# EAGLE design TestBoardRevA (EAGLE 7.5.0)
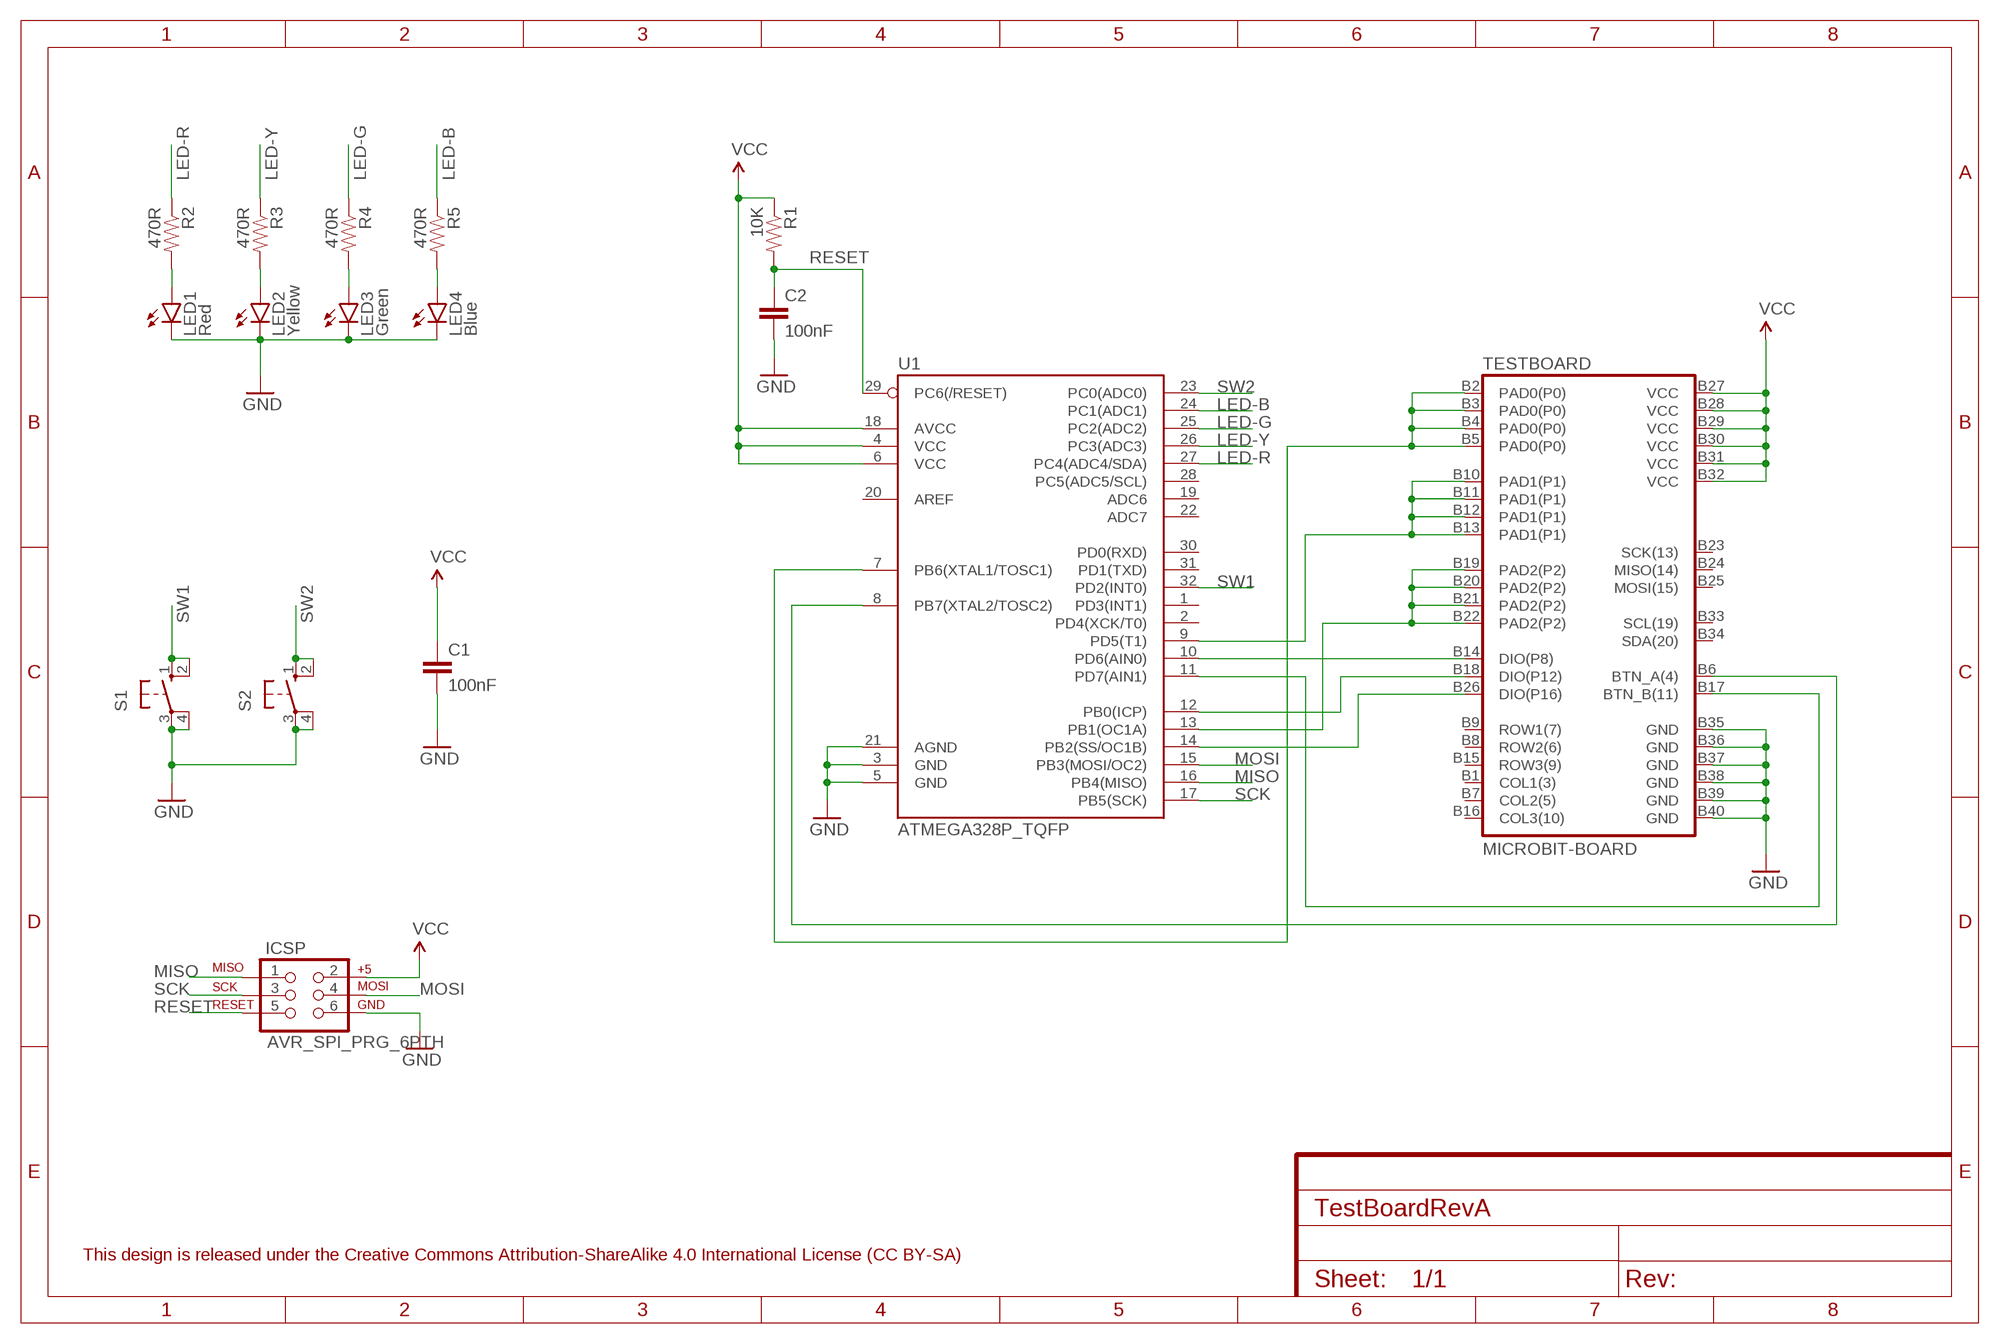
[diagram p0: schematic, sheet 1]
FRAME1 (FRAME-A4L): CNAME: MicroBit Test Board; CREVISION: A 12/2015; DESIGNER: A J Instone-Cowie

## Parts
C1  100nF  CAP0603-CAP  [0603-CAP]
C2  100nF  CAP0603-CAP  [0603-CAP]
ICSP  AVR_SPI_PRG_6PTH  [2X3]
LED1  Red  LED0603  [LED-0603]
LED2  Yellow  LED0603  [LED-0603]
LED3  Green  LED0603  [LED-0603]
LED4  Blue  LED0603  [LED-0603]
R1  10K  RESISTOR0603-RES  [0603-RES]
R2  470R  RESISTOR0603-RES  [0603-RES]
R3  470R  RESISTOR0603-RES  [0603-RES]
R4  470R  RESISTOR0603-RES  [0603-RES]
R5  470R  RESISTOR0603-RES  [0603-RES]
S1  10-XX  [B3F-10XX]
S2  10-XX  [B3F-10XX]
TESTBOARD  MICROBIT-BOARD  [MICROBIT-EDGE-CONN]
U1  ATMEGA328P_TQFP  [TQFP32-08]

## Nets
GND: C1.2 C2.2 ICSP.6 LED1.C LED2.C LED3.C LED4.C S1.3(P) S1.4(P1) S2.3(P) S2.4(P1) TESTBOARD.B35(GND) TESTBOARD.B36(GND) TESTBOARD.B37(GND) TESTBOARD.B38(GND) TESTBOARD.B39(GND) TESTBOARD.B40(GND) U1.3(GND) U1.5(GND) U1.21(AGND)
LED-B: R5.1 U1.24(PC1(ADC1))
LED-G: R4.1 U1.25(PC2(ADC2))
LED-R: R2.1 U1.27(PC4(ADC4/SDA))
LED-Y: R3.1 U1.26(PC3(ADC3))
MISO: ICSP.1 U1.16(PB4(MISO))
MOSI: ICSP.4 U1.15(PB3(MOSI/OC2))
N$1: LED3.A R4.2
N$2: TESTBOARD.B2(PAD0(P0)) TESTBOARD.B3(PAD0(P0)) TESTBOARD.B4(PAD0(P0)) TESTBOARD.B5(PAD0(P0)) U1.7(PB6(XTAL1/TOSC1))
N$3: TESTBOARD.B6(BTN_A(4)) U1.8(PB7(XTAL2/TOSC2))
N$4: TESTBOARD.B19(PAD2(P2)) TESTBOARD.B20(PAD2(P2)) TESTBOARD.B21(PAD2(P2)) TESTBOARD.B22(PAD2(P2)) U1.13(PB1(OC1A))
N$5: LED4.A R5.2
N$6: TESTBOARD.B10(PAD1(P1)) TESTBOARD.B11(PAD1(P1)) TESTBOARD.B12(PAD1(P1)) TESTBOARD.B13(PAD1(P1)) U1.9(PD5(T1))
N$8: LED1.A R2.2
N$10: TESTBOARD.B14(DIO(P8)) U1.10(PD6(AIN0))
N$11: TESTBOARD.B18(DIO(P12)) U1.12(PB0(ICP))
N$12: TESTBOARD.B26(DIO(P16)) U1.14(PB2(SS/OC1B))
N$13: TESTBOARD.B17(BTN_B(11)) U1.11(PD7(AIN1))
N$16: LED2.A R3.2
RESET: C2.1 ICSP.5 R1.2 U1.29(PC6(/RESET))
SCK: ICSP.3 U1.17(PB5(SCK))
SW1: S1.1(S) S1.2(S1) U1.32(PD2(INT0))
SW2: S2.1(S) S2.2(S1) U1.23(PC0(ADC0))
VCC: C1.1 ICSP.2 R1.1 TESTBOARD.B27(VCC) TESTBOARD.B28(VCC) TESTBOARD.B29(VCC) TESTBOARD.B30(VCC) TESTBOARD.B31(VCC) TESTBOARD.B32(VCC) U1.4(VCC) U1.6(VCC) U1.18(AVCC)
Unconnected: TESTBOARD.B1(COL1(3)) TESTBOARD.B7(COL2(5)) TESTBOARD.B8(ROW2(6)) TESTBOARD.B9(ROW1(7)) TESTBOARD.B15(ROW3(9)) TESTBOARD.B16(COL3(10)) TESTBOARD.B23(SCK(13)) TESTBOARD.B24(MISO(14)) TESTBOARD.B25(MOSI(15)) TESTBOARD.B33(SCL(19)) TESTBOARD.B34(SDA(20)) U1.1(PD3(INT1)) U1.2(PD4(XCK/T0)) U1.19(ADC6) U1.20(AREF) U1.22(ADC7) U1.28(PC5(ADC5/SCL)) U1.30(PD0(RXD)) U1.31(PD1(TXD))

## Notes on the sheet
- This design is released under the Creative Commons Attribution-ShareAlike 4.0 International License (CC BY-SA)

## Library data of the parts
C1 C2 = SparkFun-Capacitors:CAP: Capacitor Standard 0603 ceramic capacitor, and 0.1" leaded capacitor.
ICSP = SparkFun-Connectors:AVR_SPI_PRG_6: AVR ISP 6 Pin This is the reduced ISP connector for AVR programming. Common on Arduino. This footprint will take up less PCB space and can be used with a 10-pin to 6-pin adapter such as SKU: BOB-08508 **Special note about "TEST_POINT" package. The stop mask is on the top side, so if you want your programming test points to be on the bottom of your board, make sure to place this package on the bottom side of the board. This also ensure that the orientation to program from the bottom side will be correct.
LED1-LED4 = SparkFun-LED:LED: LEDs Standard schematic elements and footprints for 5mm, 3mm, 1206, and 0603 sized LEDs. 5mm - Spark Fun Electronics SKU : COM-00529 (and others)
R1-R5 = SparkFun-Passives:RESISTOR: Resistor Basic schematic elements and footprints for 0603, 1206, and PTH resistors.
S1 S2 = switch-omron:10-XX: OMRON SWITCH; MPN: B3F-1000; OC_FARNELL: 176432; OC_NEWARK: 36M3542
TESTBOARD = MicroBit_Custom:MICROBIT-: Not yet complete or validated - DO NOT USE
U1 = SparkFun-DigitalIC:ATMEGA328P_TQFP; PROD_ID: IC-09069

## Board
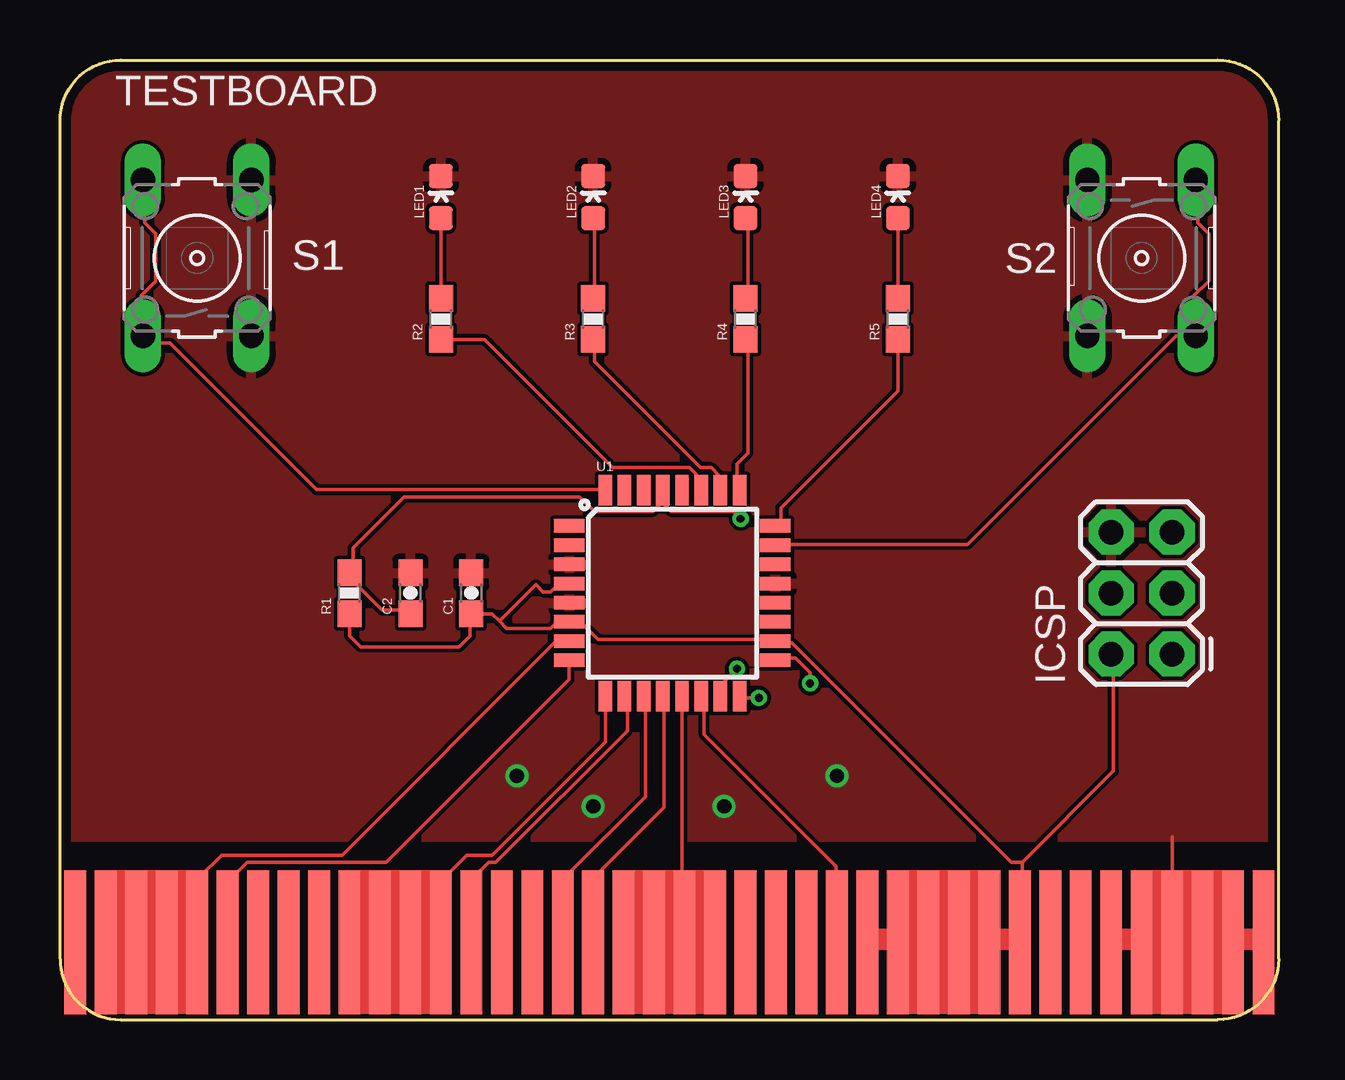
[diagram p1: board, top side]
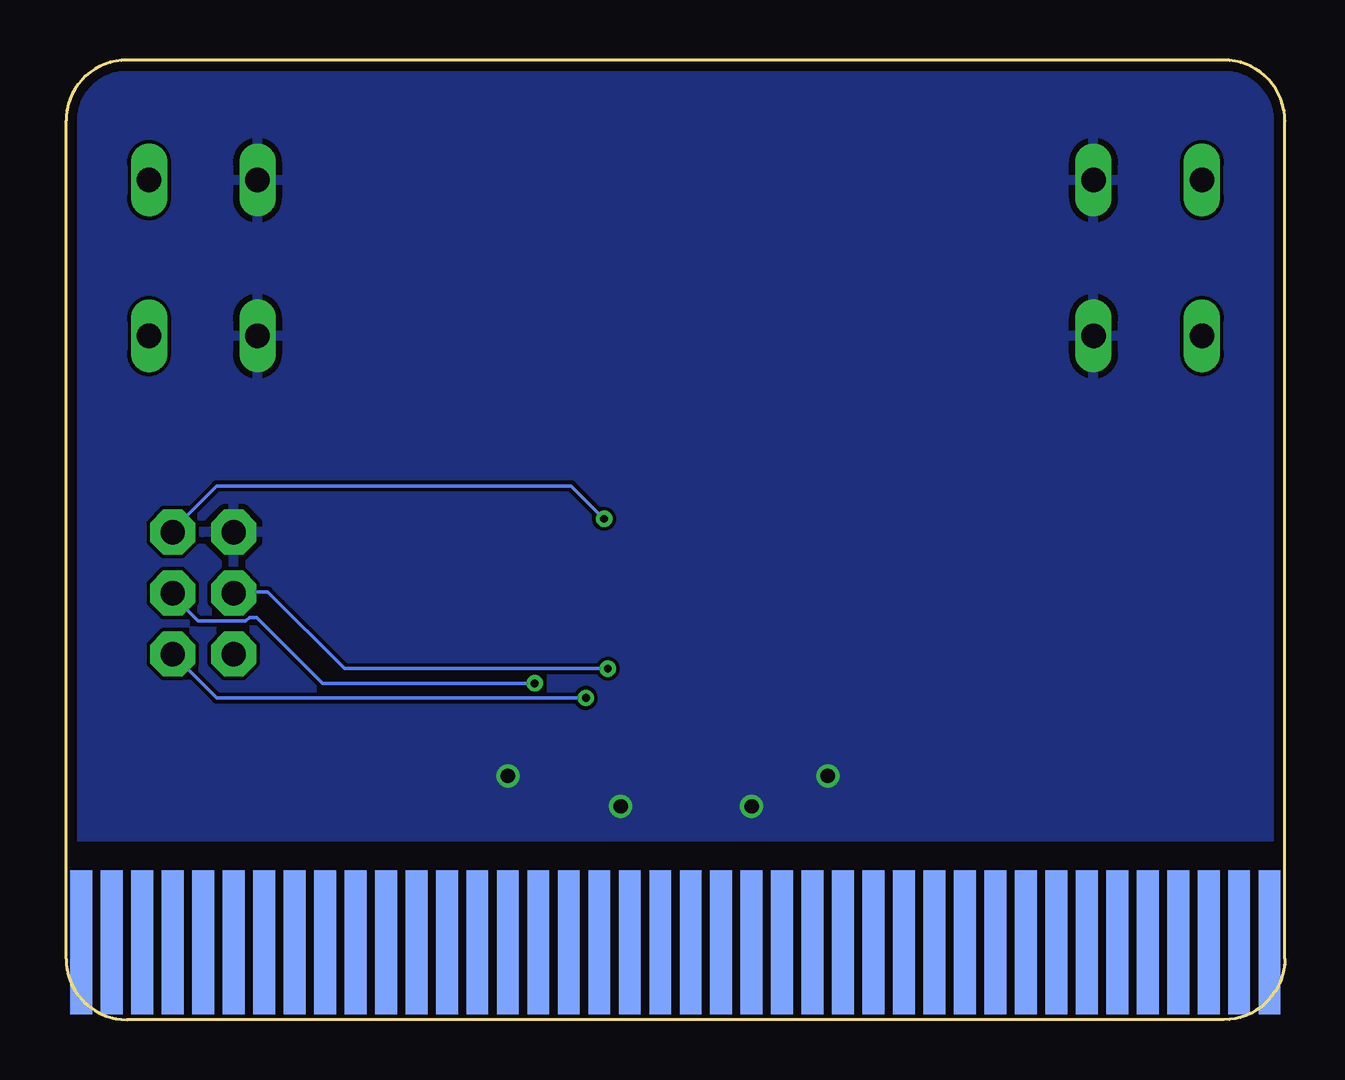
[diagram p2: board, bottom side, seen from below]

Size 50.8 x 40.01 mm. Coordinates in mm from the lower left corner, seen from the top.
Copper layers (1*16): Top 0.0356mm / dielectric 1.5011mm / Bottom 0.0356mm
Design rules "LaenPCBOrder(OSHPARK)": minimum track width 6mil, minimum drill 13mil, track to track 6mil, track to pad 6mil, pad to pad 6mil, via to via 6mil, smd to smd 6mil, copper to edge 15mil, drill to drill 6mil, minimum pad ring 7mil, minimum via ring 7mil, stop-mask expansion 3mil, vias tented up to drill 0mil, thermal gap 10mil

### Footprints (pad centres in the part's own frame; a part is rotated, then mirrored left to right if it is on the bottom)
0603-CAP = smd 1.1 x 1: 1 -0.85,0; 2 0.85,0
2X3 = drill 1.016 pad 1.88 octagon: 1 0,0; 2 0,2.54; 3 2.54,0; 4 2.54,2.54; 5 5.08,0; 6 5.08,2.54
LED-0603 = smd 1 x 1: A 0,-0.877; C 0,0.877
0603-RES = smd 1.1 x 1: 1 -0.85,0; 2 0.85,0
B3F-10XX = drill 1.016 long: 1 -3.251,2.261; 2 3.251,2.261; 3 -3.251,-2.261; 4 3.251,-2.261
MICROBIT-EDGE-CONN = smd 0.91 x 6 bottom: A1 0,3.22; A2 1.27,3.22; A3 2.54,3.22; A4 3.81,3.22; A5 5.08,3.22; A6 6.35,3.22; A7 7.62,3.22; A8 8.89,3.22; A9 10.16,3.22; A10 11.43,3.22; A11 12.7,3.22; A12 13.97,3.22; A13 15.24,3.22; A14 16.51,3.22; A15 17.78,3.22; A16 19.05,3.22; A17 20.32,3.22; A18 21.59,3.22; A19 22.86,3.22; A20 24.13,3.22; A21 25.4,3.22; A22 26.67,3.22; A23 27.94,3.22; A24 29.21,3.22; A25 30.48,3.22; A26 31.75,3.22; A27 33.02,3.22; A28 34.29,3.22; A29 35.56,3.22; A30 36.83,3.22; A31 38.1,3.22; A32 39.37,3.22; A33 40.64,3.22; A34 41.91,3.22; A35 43.18,3.22; A36 44.45,3.22; A37 45.72,3.22; A38 46.99,3.22; A39 48.26,3.22; A40 49.53,3.22 | smd 0.91 x 6: B1 0,3.22; B2 1.27,3.22; B3 2.54,3.22; B4 3.81,3.22; B5 5.08,3.22; B6 6.35,3.22; B7 7.62,3.22; B8 8.89,3.22; B9 10.16,3.22; B10 11.43,3.22; B11 12.7,3.22; B12 13.97,3.22; B13 15.24,3.22; B14 16.51,3.22; B15 17.78,3.22; B16 19.05,3.22; B17 20.32,3.22; B18 21.59,3.22; B19 22.86,3.22; B20 24.13,3.22; B21 25.4,3.22; B22 26.67,3.22; B23 27.94,3.22; B24 29.21,3.22; B25 30.48,3.22; B26 31.75,3.22; B27 33.02,3.22; B28 34.29,3.22; B29 35.56,3.22; B30 36.83,3.22; B31 38.1,3.22; B32 39.37,3.22; B33 40.64,3.22; B34 41.91,3.22; B35 43.18,3.22; B36 44.45,3.22; B37 45.72,3.22; B38 46.99,3.22; B39 48.26,3.22; B40 49.53,3.22
TQFP32-08 = smd 1.27 x 0.559: 1 -4.293,2.8; 2 -4.293,2; 3 -4.293,1.2; 4 -4.293,0.4; 5 -4.293,-0.4; 6 -4.293,-1.2; 7 -4.293,-2; 8 -4.293,-2.8; 17 4.293,-2.8; 18 4.293,-2; 19 4.293,-1.2; 20 4.293,-0.4; 21 4.293,0.4; 22 4.293,1.2; 23 4.293,2; 24 4.293,2.8 | smd 0.559 x 1.27: 9 -2.8,-4.293; 10 -2,-4.293; 11 -1.2,-4.293; 12 -0.4,-4.293; 13 0.4,-4.293; 14 1.2,-4.293; 15 2,-4.293; 16 2.8,-4.293; 25 2.8,4.293; 26 2,4.293; 27 1.2,4.293; 28 0.4,4.293; 29 -0.4,4.293; 30 -1.2,4.293; 31 -2,4.293; 32 -2.8,4.293

### Placement (x,y rotation side)
C1  17.15,17.78 90 top
C2  14.61,17.78 90 top
ICSP  46.35,15.24 90 top
LED1  15.88,34.29 0 top
LED2  22.23,34.29 0 top
LED3  28.58,34.29 0 top
LED4  34.92,34.29 0 top
R1  12.06,17.78 90 top
R2  15.88,29.21 90 top
R3  22.23,29.21 90 top
R4  28.58,29.21 90 top
R5  34.92,29.21 90 top
S1  5.71,31.75 90 top
S2  45.09,31.75 270 top
TESTBOARD  0.64,0 0 top
U1  25.53,17.78 0 top

### Tracks (layer width: path | path; a pad name or v marks a point on that pad's centre or on a via)
GND  (via drill 0.6 pad 0.25)
  Top 0.089: 48.79,3.35 47.73,3.35
  Top 0.152: 43.92,3.35 TESTBOARD.B35 | 44.98,3.35 TESTBOARD.B36 45.14,3.35 | 47.73,3.35 TESTBOARD.B38 47.57,3.35 | 48.79,3.35 TESTBOARD.B39 48.95,3.35 | 50.16,3.35 TESTBOARD.B40 | 46.35,7.62 46.35,3.35 TESTBOARD.B37
  Top 0.889: 44.98,3.35 43.92,3.35 | 45.14,3.35 46.35,3.35 47.57,3.35 | 48.95,3.35 50.16,3.35
  other vias: 32.38,10.16 19.05,10.16 22.23,8.89 27.69,8.89
  pour Top: 0,7.62 50.8,7.62 50.8,7.49 arc90 50.93,7.62 50.93,37.34 arc90 48.26,40.01 2.54,40.01 arc90 0,37.47
  pour Bottom: 0,37.34 0,7.62 50.8,7.62 50.8,37.47 arc90 48.26,40.01 2.41,40.01 arc90 0,37.59
LED-B
  Top 0.152: R5.1 34.92,26.21 30.05,21.34 30.05,20.73 29.9,20.57 U1.24
LED-G
  Top 0.152: R4.1 28.68,28.35 28.68,23.62 28.22,23.16 28.22,22.1 U1.25
LED-R
  Top 0.152: R2.1 15.88,28.35 17.7,28.35 23.04,23.01 26.24,23.01 26.7,22.55 26.7,22.1 U1.27
LED-Y
  Top 0.152: R3.1 22.28,28.35 22.28,27.43 26.7,23.01 27.15,23.01 27.46,22.71 27.46,22.1 U1.26
MISO  (via drill 0.33)
  Top 0.152: v29.13,13.41 28.37,13.41 U1.16
  Bottom 0.152: v29.13,13.41 44.53,13.41 ICSP.1
MOSI  (via drill 0.33)
  Top 0.152: v28.22,14.63 27.61,14.02 27.61,13.56 U1.15
  Bottom 0.152: v28.22,14.63 39.19,14.63 42.39,17.83 43.76,17.83 ICSP.4
N$1
  Top 0.152: LED3.A 28.68,33.38 28.68,30.18 R4.2
N$2
  Top 0.152: 2.01,3.35 TESTBOARD.B2 | 3.07,3.35 TESTBOARD.B3 3.23,3.35 | U1.7 21.21,15.7 20.6,15.7 11.76,6.86 6.73,6.86 5.82,5.94 5.82,3.35 TESTBOARD.B5 5.66,3.35 | 4.45,3.35 TESTBOARD.B4
  Top 0.889: 3.07,3.35 2.01,3.35 | 3.23,3.35 4.45,3.35 5.66,3.35
N$3
  Top 0.152: U1.8 21.21,14.94 21.21,14.17 13.59,6.55 7.8,6.55 7.04,5.79 7.04,3.35 TESTBOARD.B6
N$4
  Top 0.152: 23.5,3.35 TESTBOARD.B19 | 24.71,3.35 TESTBOARD.B20 24.87,3.35 | U1.13 25.93,13.41 25.93,3.35 TESTBOARD.B21 26.09,3.35 | 27.31,3.35 TESTBOARD.B22
  Top 0.889: 24.71,3.35 23.5,3.35 | 26.09,3.35 27.31,3.35 | 25.93,3.35 24.87,3.35
N$5
  Top 0.152: R5.2 LED4.A
N$6
  Top 0.152: 12.06,3.35 TESTBOARD.B10 | 13.28,3.35 TESTBOARD.B11 13.44,3.35 | 14.5,3.35 TESTBOARD.B12 14.66,3.35 | U1.9 22.73,13.41 22.73,11.58 18.01,6.86 16.94,6.86 15.88,5.79 15.88,3.35 TESTBOARD.B13
  Top 0.889: 13.28,3.35 12.06,3.35 | 13.44,3.35 14.5,3.35 | 15.88,3.35 14.66,3.35
N$8
  Top 0.152: R2.2 LED1.A
N$10
  Top 0.152: U1.10 23.65,13.41 23.65,12.04 18.16,6.55 17.86,6.55 17.25,5.94 17.25,3.35 TESTBOARD.B14
N$11
  Top 0.152: U1.12 25.17,13.41 25.17,8.84 22.28,5.94 22.28,3.35 TESTBOARD.B18
N$12
  Top 0.152: U1.14 26.85,13.41 26.85,11.89 32.33,6.4 32.33,3.35 TESTBOARD.B26
N$13
  Top 0.152: U1.11 24.41,13.41 24.41,9.3 21.06,5.94 21.06,3.35 TESTBOARD.B17
N$16
  Top 0.152: LED2.A 22.28,33.38 22.28,30.18 R3.2
RESET  (via drill 0.33)
  Top 0.152: C2.1 14.5,17.07 13.44,17.07 12.06,18.44 R1.2 12.06,18.75 12.22,18.9 12.22,19.66 14.35,21.79 21.67,21.79 22.28,21.18 24.71,21.18 25.02,21.49 25.02,21.95 U1.29 25.17,21.95 25.17,21.49 25.48,21.18 28.07,21.18 v28.37,20.88
  Bottom 0.152: v28.37,20.88 29.74,22.25 44.53,22.25 46.35,20.42 ICSP.5
SCK  (via drill 0.33)
  Top 0.152: v31.27,14.02 31.27,14.48 30.66,15.09 29.9,15.09 U1.17
  Bottom 0.152: v31.27,14.02 40.11,14.02 42.85,16.76 43.16,16.76 43.31,16.61 45.29,16.61 46.35,17.68 ICSP.3
SW1
  Top 0.152: U1.32 22.58,22.1 10.69,22.1 4.6,28.19 3.83,28.19 3.53,28.5 S1.1 3.38,28.5 3.38,30.18 3.99,30.79 3.99,32.77 3.53,33.22 3.53,34.9 S1.2
SW2
  Top 0.152: 47.27,28.5 46.51,28.5 37.82,19.81 29.9,19.81 U1.23 | 47.27,28.5 47.27,30.18 47.88,30.79 47.88,32.77 47.42,33.22 47.42,34.9 S2.1 | 47.27,28.5 S2.2
VCC
  Top 0.152: R1.1 12.06,16 12.52,15.54 16.64,15.54 17.09,16 17.09,16.92 C1.1 17.25,16.92 18.01,16.92 18.31,16.61 | 18.31,16.61 18.62,16.31 20.45,16.31 20.6,16.46 21.21,16.46 U1.6 21.36,16.46 21.82,16.46 22.43,15.85 29.74,15.85 U1.18 29.9,15.7 30.51,15.7 39.65,6.55 40.11,6.55 | 18.31,16.61 19.84,18.14 20.14,17.83 20.45,17.83 20.75,18.14 21.21,18.14 U1.4 | 33.71,3.35 TESTBOARD.B27 | 36.3,3.35 TESTBOARD.B29 36.14,3.35 | 37.36,3.35 TESTBOARD.B30 37.52,3.35 | 34.92,3.35 TESTBOARD.B28 | 40.11,6.55 43.92,10.36 43.92,15.24 ICSP.2 | 40.11,6.55 40.11,3.35 TESTBOARD.B32 39.95,3.35 | 38.73,3.35 TESTBOARD.B31
  Top 0.889: 33.71,3.35 34.92,3.35 36.14,3.35 | 37.36,3.35 36.3,3.35 | 37.52,3.35 38.73,3.35 39.95,3.35
(copper drawn outside any net)
  shapes: Top area x5